# EAGLE design Shruthi-Analog-Polivoks-v01 (EAGLE 5.09)
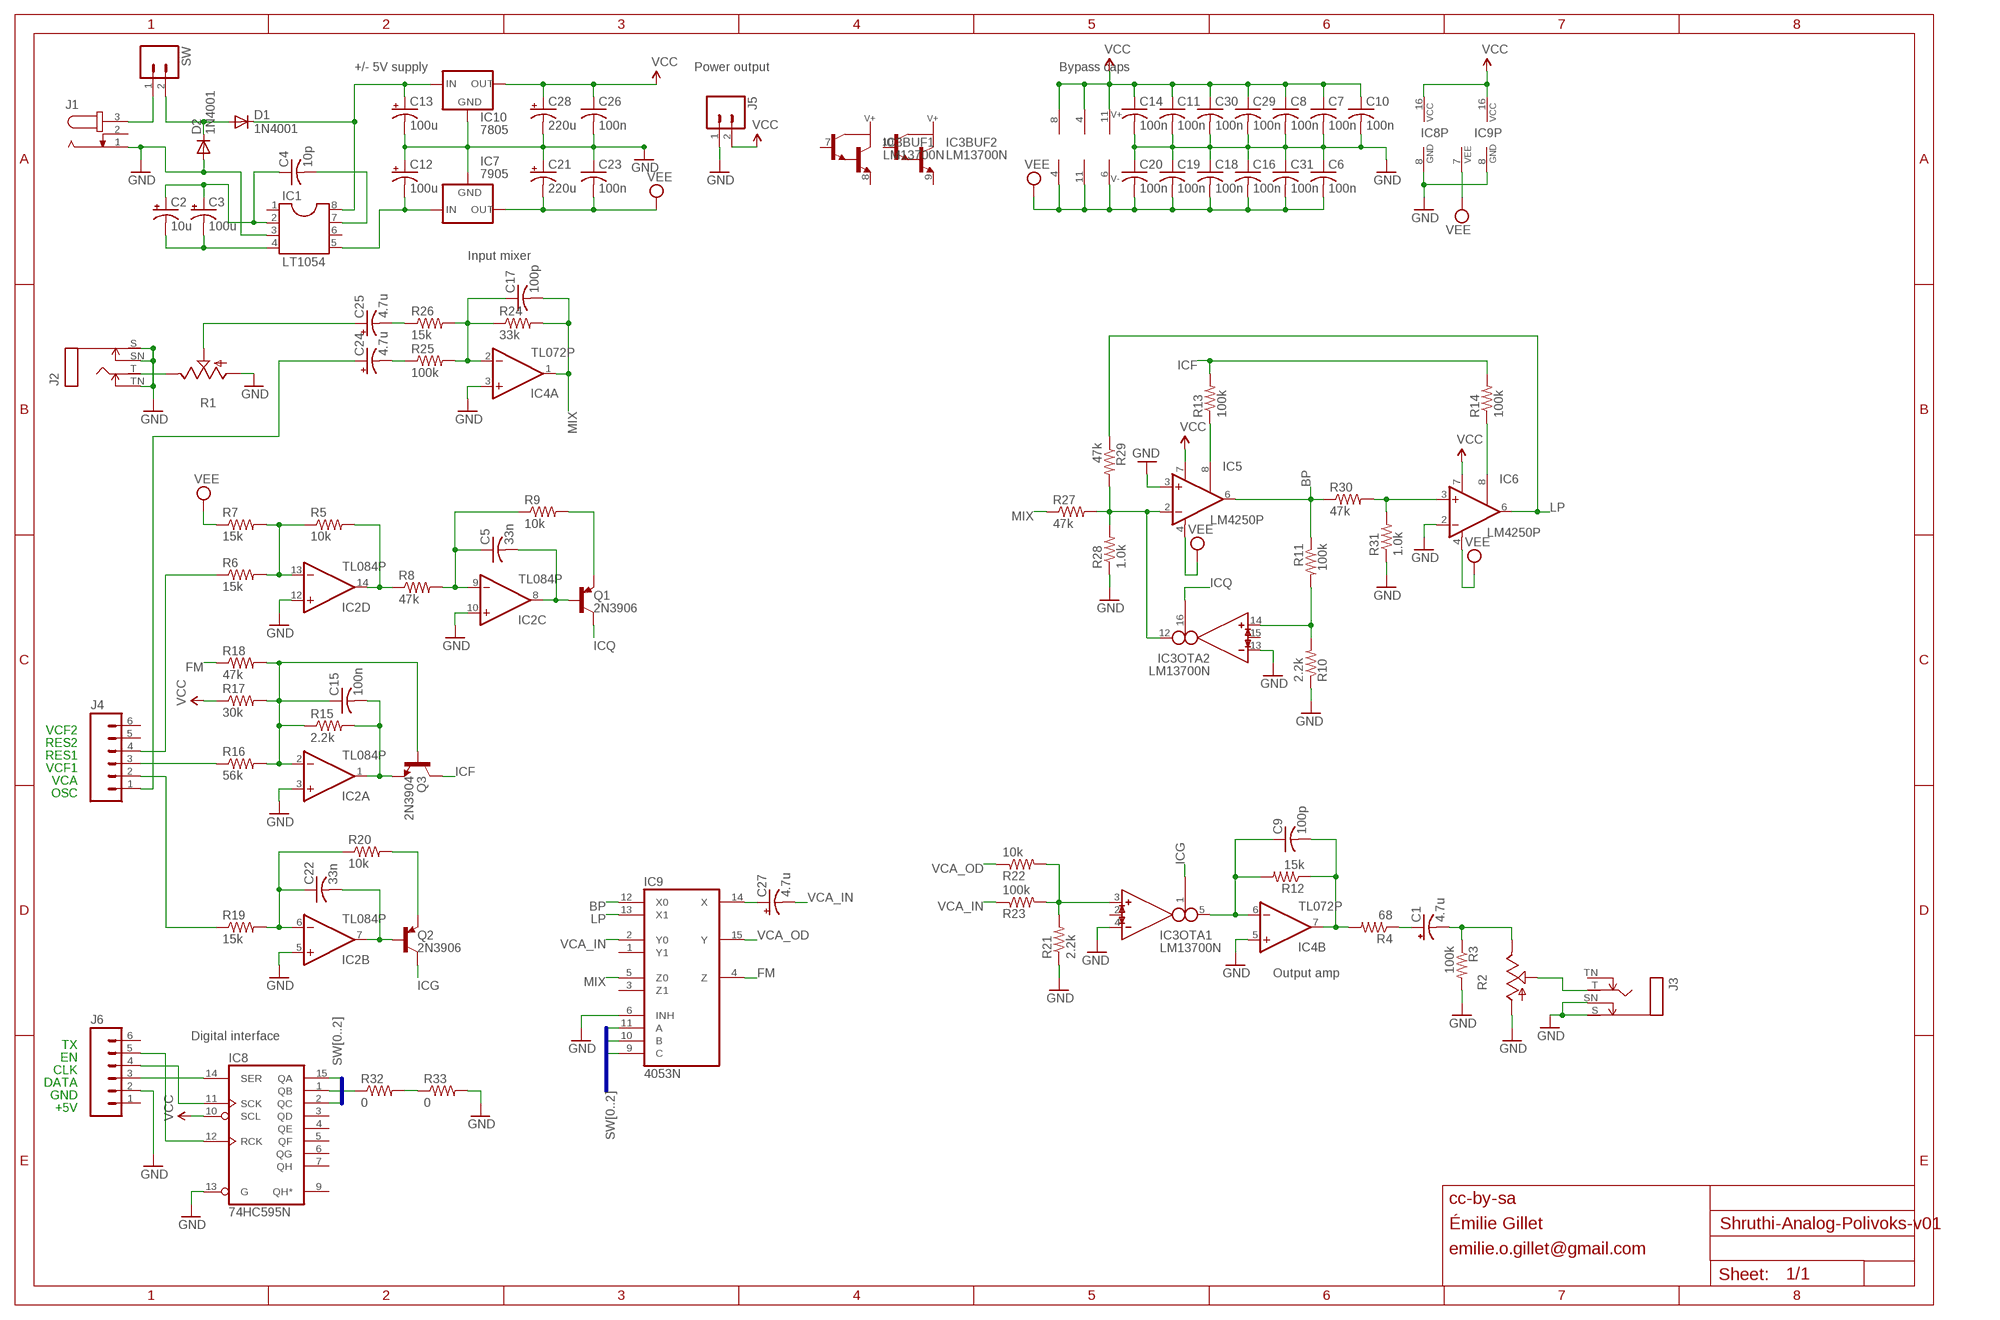
[diagram p0: schematic, sheet 1]

## Parts
C1  4.7u  CPOL-USE2.5-6  [E2,5-6]
C2  10u  CPOL-USE2.5-5  [E2,5-5]
C3  100u  CPOL-USE2.5-6  [E2,5-6]
C4  10p  C-US025-025X050  [C025-025X050]
C5  33n  C-US050-025X075  [C050-025X075]
C6  100n  C-US025-025X050  [C025-025X050]
C7  100n  C-US025-025X050  [C025-025X050]
C8  100n  C-US025-025X050  [C025-025X050]
C9  100p  C-US025-025X050  [C025-025X050]
C10  100n  C-US025-025X050  [C025-025X050]
C11  100n  C-US025-025X050  [C025-025X050]
C12  100u  CPOL-USE2.5-7  [E2,5-7]
C13  100u  CPOL-USE2.5-7  [E2,5-7]
C14  100n  C-US025-025X050  [C025-025X050]
C15  100n  C-US025-025X050  [C025-025X050]
C16  100n  C-US025-025X050  [C025-025X050]
C17  100p  C-US025-025X050  [C025-025X050]
C18  100n  C-US025-025X050  [C025-025X050]
C19  100n  C-US025-025X050  [C025-025X050]
C20  100n  C-US025-025X050  [C025-025X050]
C21  220u  CPOL-USE5-10.5  [E5-10,5]
C22  33n  C-US050-025X075  [C050-025X075]
C23  100n  C-US025-025X050  [C025-025X050]
C24  4.7u  CPOL-USE2.5-6  [E2,5-6]
C25  4.7u  CPOL-USE2.5-6  [E2,5-6]
C26  100n  C-US025-025X050  [C025-025X050]
C27  4.7u  CPOL-USE2.5-6  [E2,5-6]
C28  220u  CPOL-USE5-10.5  [E5-10,5]
C29  100n  C-US025-025X050  [C025-025X050]
C30  100n  C-US025-025X050  [C025-025X050]
C31  100n  C-US025-025X050  [C025-025X050]
D1  1N4001  1N4004  [DO41-10]
D2  1N4001  1N4004  [DO41-10]
IC1  LT1054  DIL8  [DIL08]
IC2  TL084P  [DIL14]
IC3  LM13700N  [DIL16]
IC4  TL072P  [DIL08]
IC5  LM4250P  [DIL08]
IC6  LM4250P  [DIL08]
IC7  7905  79XXS  [79XXS]
IC8  74HC595N  [DIL16]
IC9  4053N  [DIL16]
IC10  7805  78XXS  [78XXS]
J1  JACK-PLUG2  [SPC4078_BIG_HOLES]
J2  MONOSWS  [NMJ4HC-S]
J3  MONOSWS  [NMJ4HC-S]
J4  M06SIP  [1X06]
J5  M02PTH  [1X02]
J6  M06SIP  [1X06]
Q1  2N3906  2N3906-  [TO92-]
Q2  2N3906  2N3906-  [TO92-]
Q3  2N3904  [TO92-]
R1  POT_USCABLED  [CABLE_POT_6MM]
R2  POT_USCABLED  [CABLE_POT_6MM]
R3  100k  R-US_0204/7  [0204/7]
R4  68  R-US_0204/7  [0204/7]
R5  10k  R-US_0204/7  [0204/7]
R6  15k  R-US_0204/7  [0204/7]
R7  15k  R-US_0204/7  [0204/7]
R8  47k  R-US_0204/7  [0204/7]
R9  10k  R-US_0204/7  [0204/7]
R10  2.2k  R-US_0204/7  [0204/7]
R11  100k  R-US_0204/7  [0204/7]
R12  15k  R-US_0204/7  [0204/7]
R13  100k  R-US_0204/7  [0204/7]
R14  100k  R-US_0204/7  [0204/7]
R15  2.2k  R-US_0204/7  [0204/7]
R16  56k  R-US_0204/7  [0204/7]
R17  30k  R-US_0204/7  [0204/7]
R18  47k  R-US_0204/7  [0204/7]
R19  15k  R-US_0204/7  [0204/7]
R20  10k  R-US_0204/7  [0204/7]
R21  2.2k  R-US_0204/7  [0204/7]
R22  10k  R-US_0204/7  [0204/7]
R23  100k  R-US_0204/7  [0204/7]
R24  33k  R-US_0204/7  [0204/7]
R25  100k  R-US_0204/7  [0204/7]
R26  15k  R-US_0204/7  [0204/7]
R27  47k  R-US_0204/7  [0204/7]
R28  1.0k  R-US_0204/7  [0204/7]
R29  47k  R-US_0204/7  [0204/7]
R30  47k  R-US_0204/7  [0204/7]
R31  1.0k  R-US_0204/7  [0204/7]
R32  0  R-US_0204/2V  [0204V]
R33  0  R-US_0204/2V  [0204V]
SW  M02PTH  [1X02]

## Nets
BP: IC5.6(OUT) IC9.12(X0) R11.1 R30.1
FM: IC9.4(Z) R18.1
FREQ1: C15.2 IC2.1(A:OUT) Q3.3(E) R15.2
FREQ2: C5.2 IC2.8(C:OUT) Q1.2(B)
GND: C6.1 C7.2 C8.2 C10.2 C11.2 C12.+ C13.- C14.2 C16.1 C18.1 C19.1 C20.1 C21.+ C23.1 C26.2 C28.- C29.2 C30.2 C31.1 D2.A IC1.3 IC2.3(A:+IN) IC2.5(B:+IN) IC2.10(C:+IN) IC2.12(D:+IN) IC3.4(OTA1:IN_N) IC3.13(OTA2:IN_N) IC4.3(A:+IN) IC4.5(B:+IN) IC5.3(+IN) IC6.2(-IN) IC7.GND IC8.8(GND) IC8.13(G) IC9.6(INH) IC9.8(GND) IC10.GND J1.1 J2.S J2.SN J2.TN J3.S J3.SN J5.1 J6.2 R1.A R2.A R3.2 R10.1 R21.1 R28.1 R31.1 R33.2
ICF: Q3.1(C) R13.2 R14.2
ICG: IC3.1(OTA1:I_BIAS) Q2.1(C)
ICQ: IC3.16(OTA2:I_BIAS) Q1.1(C)
LP: IC6.6(OUT) IC9.13(X1) R29.1
MIX: C17.2 IC4.1(A:OUT) IC9.5(Z0) R24.2 R27.1
N$1: C2.+ C3.+ C4.1 IC1.2
N$2: J4.4 R6.1
N$3: J1.3 SW.1
N$4: C13.+ D1.C IC1.8 IC10.IN
N$5: C2.- C3.- IC1.4
N$6: C17.1 IC4.2(A:-IN) R24.1 R25.2 R26.2
N$7: C22.1 IC2.6(B:-IN) R19.2 R20.1
N$9: C5.1 IC2.9(C:-IN) R8.2 R9.1
N$10: Q2.3(E) R20.2
N$11: Q1.3(E) R9.2
N$12: IC3.12(OTA2:OUT) IC5.2(-IN) R27.2 R28.2 R29.2
N$13: IC8.12(RCK) J6.5
N$14: IC8.14(SER) J6.3
N$16: IC8.11(SCK) J6.4
N$17: C27.+ IC9.14(X)
N$18: IC3.3(OTA1:IN_P) R21.2 R22.2 R23.2
N$19: IC3.14(OTA2:IN_P) R10.2 R11.2
N$20: IC6.3(+IN) R30.2 R31.2
N$21: J4.2 R19.1
N$22: IC2.13(D:-IN) R5.1 R6.2 R7.2
N$23: IC5.8(ISET) R13.1
N$24: IC6.8(ISET) R14.1
N$25: C1.+ R4.1
N$26: R32.2 R33.1
N$27: IC2.14(D:OUT) R5.2 R8.1
N$32: C1.- R2.E R3.1
N$35: C24.+ J4.1
N$36: C4.2 IC1.7
N$38: J2.T R1.E
N$39: C24.- R25.1
N$40: C15.1 IC2.2(A:-IN) Q3.2(B) R15.1 R16.2 R17.2 R18.2
N$42: J4.3 R16.1
N$47: J3.T R2.S
N$58: C12.- IC1.5 IC7.IN
N$59: D1.A D2.C SW.2
N$63: C9.2 IC4.7(B:OUT) R4.2 R12.1
N$66: C25.+ R1.S
N$70: C9.1 IC3.5(OTA1:OUT) IC4.6(B:-IN) R12.2
N$72: C25.- R26.1
SW0: IC8.15(QA) IC9.9(C)
SW1: IC8.1(QB) IC9.10(B) R32.1
SW2: IC8.2(QC) IC9.11(A)
VCA_IN: C27.- IC9.2(Y0) R23.1
VCA_OD: IC9.15(Y) R22.1
VCC: C7.1 C8.1 C10.1 C11.1 C14.1 C26.1 C28.+ C29.1 C30.1 IC2.4(P:V+) IC3.11(SUPPLY:V+) IC4.8(P:V+) IC5.7(V+) IC6.7(V+) IC8.10(SCL) IC8.16(VCC) IC9.16(VCC) IC10.OUT J5.2 R17.1
VEE: C6.2 C16.2 C18.2 C19.2 C20.2 C21.- C23.2 C31.2 IC2.11(P:V-) IC3.6(SUPPLY:V-) IC4.4(P:V-) IC5.4(V-) IC6.4(V-) IC7.OUT IC9.7(VEE) R7.1
X: C22.2 IC2.7(B:OUT) Q2.2(B)
Unconnected: IC1.1 IC1.6 IC3.2(OTA1:I_DIODE) IC3.7(BUF1:B) IC3.8(BUF1:E) IC3.9(BUF2:E) IC3.10(BUF2:B) IC3.15(OTA2:I_DIODE) IC8.3(QD) IC8.4(QE) IC8.5(QF) IC8.6(QG) IC8.7(QH) IC8.9(QH*) IC9.1(Y1) IC9.3(Z1) J1.2 J3.TN J4.5 J4.6 J6.1 J6.6

## Buses
SW[0..2]

## Notes on the sheet
- +/- 5V supply | Power output | Bypass caps
- Input mixer
- VCF2
- RES2
- RES1
- VCF1
- VCA
- OSC
- Output amp
- TX | Digital interface
- EN
- CLK
- DATA
- GND
- +5V
- cc-by-sa
- Émilie Gillet
- emilie.o.gillet@gmail.com

## Library data of the parts
C1-C3 C12 C13 C21 C24 C25 C27 C28 = rcl:CPOL-US: POLARIZED CAPACITOR, American symbol
C4-C11 C14-C20 C22 C23 C26 C29-C31 = rcl:C-US: CAPACITOR, American symbol
D1 D2 = diode:1N4004: DIODE general purpose rectifier, 1 A
IC1 = ic-package:DIL8: Dual In Line / Socket
IC2 = linear:TL084: OP AMP
IC3 = ota:LM13700: Dual OTA with buffers
IC4 = gm-ics:TL072: OP AMP
IC5 IC6 = og-ics:LM4250: OP AMP
IC7 = v-reg:79XXS: VOLTAGE REGULATOR
IC8 = 74xx-eu:74*595: 8-bit SHIFT REGISTER, output latch
IC9 = 40xx:4053: Triple 2-channel ANALOG MULTIPLEXER
IC10 = v-reg:78XXS: VOLTAGE REGULATOR
J1 = con-jack2:JACK-PLUG: DC POWER JACK Power Jack, DC, Right Angle, Through Hole, Rated 5A at 16VDC, PC Terminals Distributor: Farnell (www.Farnell.de) Drawing: 84N1161.pdf / 84N1162.pdf Manufacturer: SPC Technology (www.spctechnology.com) Type: SPC4077 / SPC 4078
J2 J3 = gm-jacks:MONOSW
J4 J6 = SparkFun:M06: Header 6 Standard 6-pin 0.1" header. Use with straight break away headers (SKU : PRT-00116), right angle break away headers (PRT-00553), swiss pins (PRT-00743), machine pins (PRT-00117), and female headers (PRT-00115). Molex polarized connector foot print use with SKU : PRT-08094 with associated crimp pins and housings. NOTES ON THE VARIANTS LOCK and LOCK_LONGPADS... This footprint was designed to help hold the alignment of a through-hole component (i.e. 6-pin header) while soldering it into place. You may notice that each hole has been shifted either up or down by 0.005 of an inch from it's more standard position (which is a perfectly straight line). This slight alteration caused the pins (the squares in the middle) to touch the edges of the holes. Because they are alternating, it causes a "brace" to hold the component in place. 0.005 has proven to be the perfect amount of "off-center" position when using our standard breakaway headers. Although looks a little odd when you look at the bare footprint, once you have a header in there, the alteration is very hard to notice. Also, if you push a header all the way into place, it is covered up entirely on the bottom side. This idea of altering the position of holes to aid alignment will be further integrated into the Sparkfun Library for other footprints. It can help hold any component with 3 or more connection pins.
J5 SW = SparkFun:M02: Header 2 Standard 2-pin 0.1" header. Use with straight break away headers (SKU : PRT-00116), right angle break away headers (PRT-00553), swiss pins (PRT-00743), machine pins (PRT-00117), and female headers (PRT-00115). Molex polarized connector foot print use with SKU : PRT-08233 with associated crimp pins and housings.
Q1 Q2 = gm-trans:2N3906: PNP Transistor
Q3 = gm-trans:2N3904: NPN Transistor
R1 R2 = pot-alps:POT_US
R3-R33 = rcl:R-US_: RESISTOR, American symbol

## Board
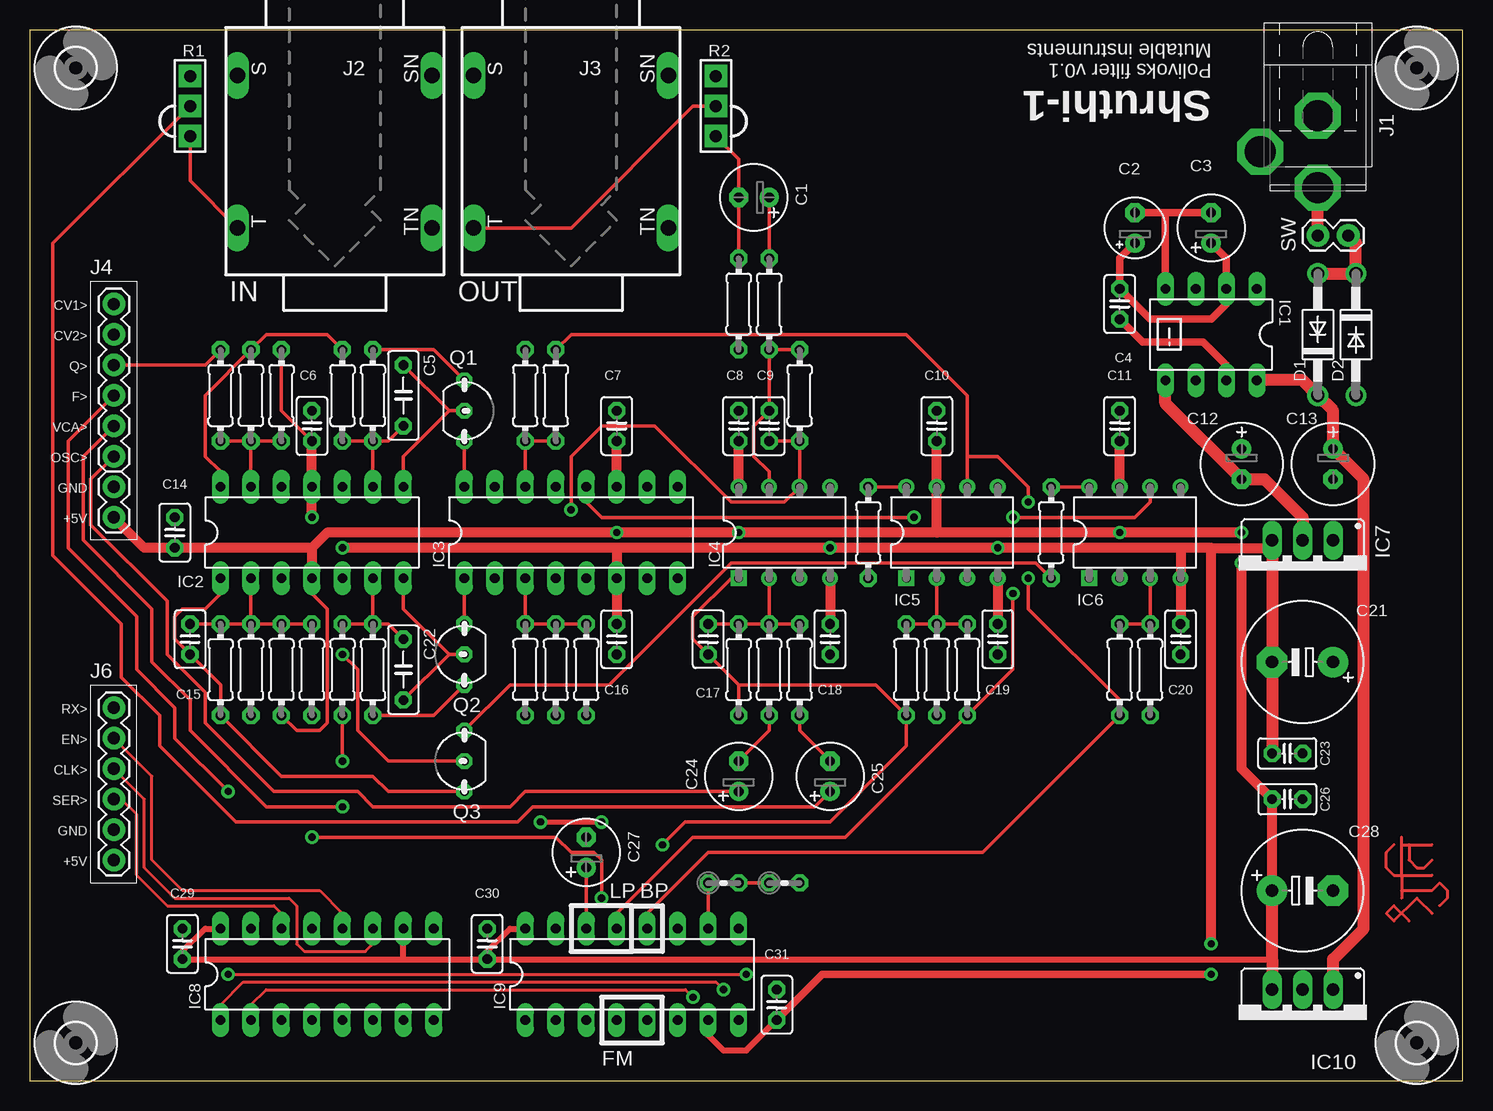
[diagram p1: board, top side]
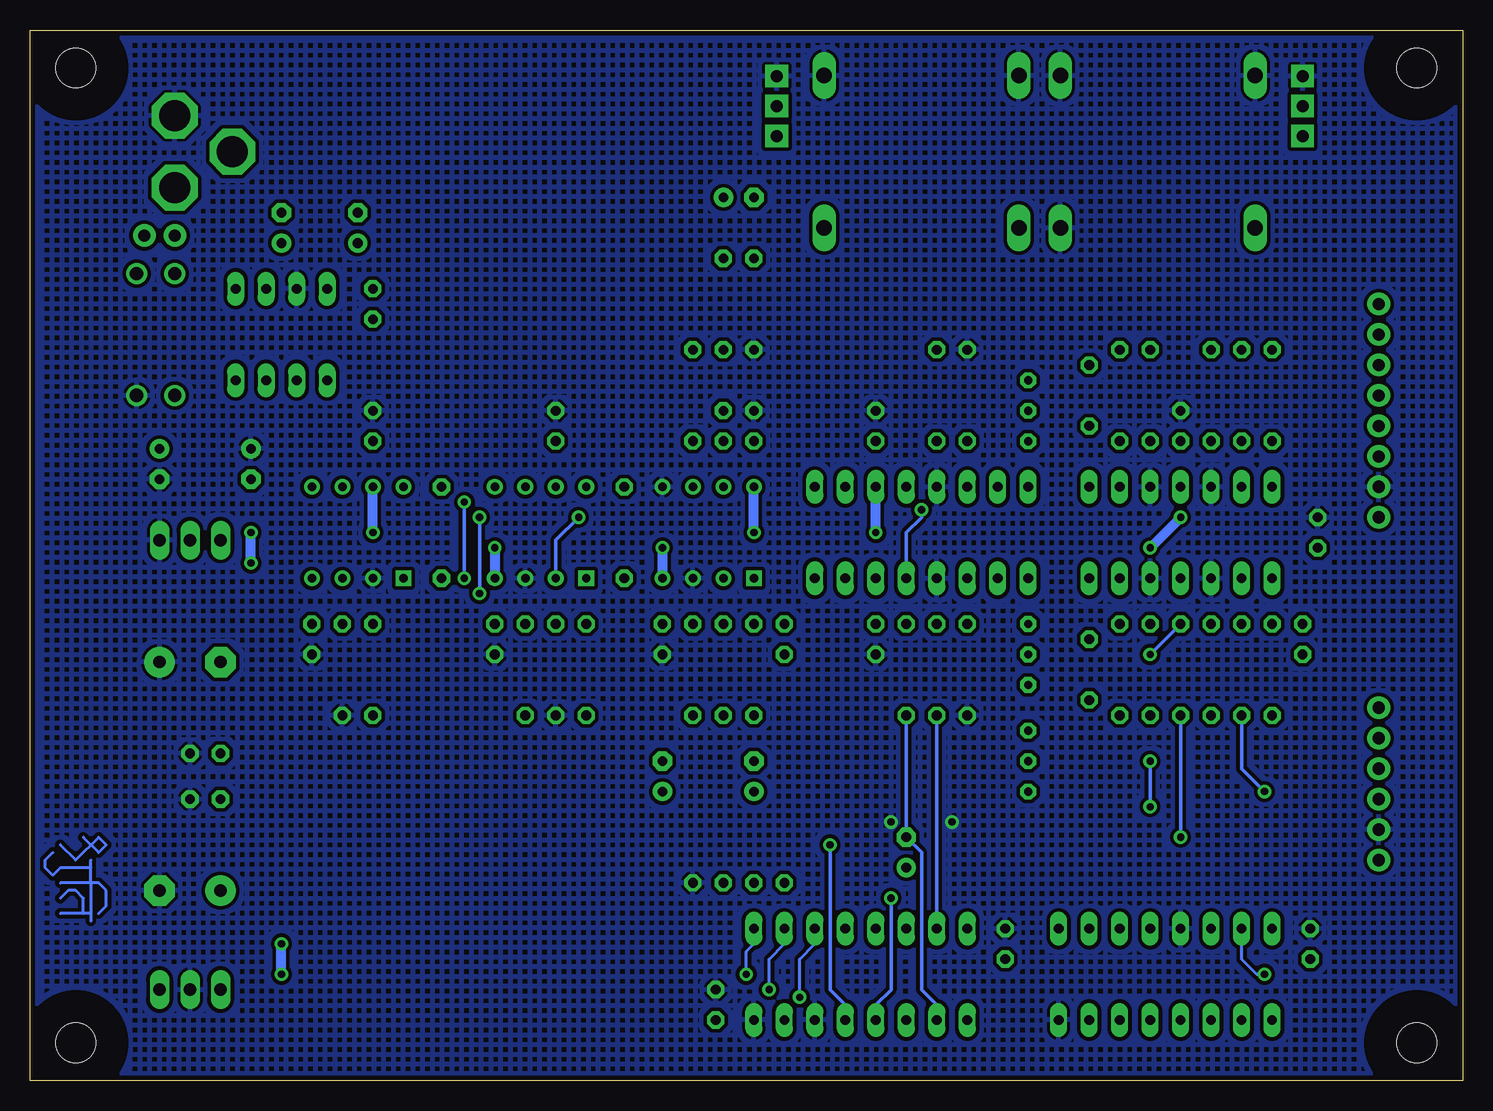
[diagram p2: board, bottom side, seen from below]

Size 119.38 x 87.62 mm. Coordinates in mm from the lower left corner, seen from the top.
Outline: 0,0 119.38,0 119.38,87.62 0,87.62 0,0
Copper layers (1*16): Top 0.035mm / dielectric 1.5mm / Bottom 0.035mm
Design rules "SparkFun_10mil *": minimum track width 10mil, minimum drill 20mil, track to track 10mil, track to pad 10mil, pad to pad 10mil, via to via 10mil, smd to smd 10mil, copper to edge 10mil, drill to drill 10mil, minimum pad ring 12mil, minimum via ring 10mil, stop-mask expansion 4mil, vias tented up to drill 25mil, thermal gap 10mil

### Footprints (pad centres in the part's own frame; a part is rotated, then mirrored left to right if it is on the bottom)
3,3 = hole 3.3: 0,0
E2,5-6 = drill 0.813 pad 1.6 round: + -1.27,0 | drill 0.813 pad 1.6 octagon: - 1.27,0
E2,5-5 = drill 0.813 pad 1.6 round: + -1.27,0 | drill 0.813 pad 1.6 octagon: - 1.27,0
C025-025X050 = drill 0.813 octagon: 1 -1.27,0; 2 1.27,0
C050-025X075 = drill 0.813 octagon: 1 -2.54,0; 2 2.54,0
E2,5-7 = drill 0.813 pad 1.6 round: + -1.27,0 | drill 0.813 pad 1.6 octagon: - 1.27,0
E5-10,5 = drill 1.016 pad 2.54 round: + -2.54,0 | drill 1.016 pad 2.54 octagon: - 2.54,0
DO41-10 = drill 1.118 round: A 5.08,0; C -5.08,0
DIL08 = drill 0.813 long: 1 -3.81,-3.81; 2 -1.27,-3.81; 3 1.27,-3.81; 4 3.81,-3.81; 5 3.81,3.81; 6 1.27,3.81; 7 -1.27,3.81; 8 -3.81,3.81
DIL14 = drill 0.813 long: 1 -7.62,-3.81; 2 -5.08,-3.81; 3 -2.54,-3.81; 4 0,-3.81; 5 2.54,-3.81; 6 5.08,-3.81; 7 7.62,-3.81; 8 7.62,3.81; 9 5.08,3.81; 10 2.54,3.81; 11 0,3.81; 12 -2.54,3.81; 13 -5.08,3.81; 14 -7.62,3.81
DIL16 = drill 0.813 long: 1 -8.89,-3.81; 2 -6.35,-3.81; 3 -3.81,-3.81; 4 -1.27,-3.81; 5 1.27,-3.81; 6 3.81,-3.81; 7 6.35,-3.81; 8 8.89,-3.81; 9 8.89,3.81; 10 6.35,3.81; 11 3.81,3.81; 12 1.27,3.81; 13 -1.27,3.81; 14 -3.81,3.81; 15 -6.35,3.81; 16 -8.89,3.81
DIL08' = drill 0.7 square: 1 -3.81,-3.81 | drill 0.7 round: 2 -1.27,-3.81; 3 1.27,-3.81; 4 3.81,-3.81; 5 3.81,3.81; 6 1.27,3.81; 7 -1.27,3.81; 8 -3.81,3.81
79XXS = drill 1.016 long: GND -2.54,-2.54; IN 0,-2.54; OUT 2.54,-2.54
78XXS = drill 1.016 long: GND 0,-2.54; IN -2.54,-2.54; OUT 2.54,-2.54
SPC4078_BIG_HOLES = drill 2.6 pad 3.81 octagon: 1 -0.46,0; 2 2.54,-4.8; 3 5.54,0
NMJ4HC-S = drill 1.3 long: S 5.08,8.115; SN 5.08,-8.115; T -7.62,8.115; TN -7.62,-8.115
1X06 = drill 1.016 pad 1.88 round: 1 0,0; 2 2.54,0; 3 5.08,0; 4 7.62,0; 5 10.16,0; 6 12.7,0
1X02 = drill 1.016 pad 1.88 round: 1 0,0; 2 2.54,0
TO92- = drill 0.7 octagon: 1 2.54,0; 2 0,0; 3 -2.54,0
CABLE_POT_6MM = drill 1 pad 1.88 square: A -2.5,0; E 2.5,0; S 0,0
0204/7 = drill 0.813 octagon: 1 -3.81,0; 2 3.81,0
0204V = drill 0.813 octagon: 1 -1.27,0; 2 1.27,0

### Placement (x,y rotation side)
$$U$4  [3,3]  115.57,3.17 0 top
C1  60.33,73.66 180 top
C2  92.08,71.12 90 top
C3  98.42,71.12 90 top
C4  90.8,64.77 270 top
C5  31.11,57.15 90 top
C6  23.5,54.61 270 top
C7  48.89,54.61 90 top
C8  59.05,54.61 90 top
C9  61.59,54.61 90 top
C10  75.56,54.61 90 top
C11  90.8,54.61 90 top
C12  100.97,51.44 270 top
C13  108.58,51.44 270 top
C14  12.07,45.72 90 top
C15  13.34,36.83 270 top
C16  48.89,36.83 90 top
C17  56.52,36.83 270 top
C18  66.67,36.83 90 top
C19  80.64,36.83 90 top
C20  95.89,36.83 90 top
C21  106.05,34.92 180 top
C22  31.11,34.29 270 top
C23  104.78,27.3 180 top
C24  59.05,25.4 90 top
C25  66.67,25.4 90 top
C26  104.78,23.49 0 top
C27  46.35,19.05 90 top
C28  106.05,15.88 0 top
C29  12.7,11.43 90 top
C30  38.1,11.43 90 top
C31  62.23,6.35 270 top
D1  107.31,62.23 90 top
D2  110.49,62.23 270 top
IC1  98.42,62.23 180 top
IC2  23.5,45.72 0 top
IC3  45.09,45.72 0 top
IC4  TL072P  [DIL08']  62.87,45.72 0 top
IC5  LM4250P  [DIL08']  76.83,45.72 0 top
IC6  LM4250P  [DIL08']  92.08,45.72 0 top
IC7  106.05,42.55 180 top
IC8  24.77,8.89 0 top
IC9  50.16,8.89 0 top
IC10  106.05,5.08 180 top
J1  107.31,80.01 270 top
J2  25.4,78.74 90 top
J3  45.09,78.74 90 top
J4  6.99,52.07 90 top
J5  6.99,49.53 270 top
J6  6.99,18.41 90 top
Q1  36.2,55.88 270 top
Q2  36.2,35.56 90 top
Q3  36.2,26.67 90 top
R1  13.34,81.28 270 top
R2  57.15,81.28 270 top
R3  59.05,64.77 270 top
R4  61.59,64.77 270 top
R5  18.41,57.15 90 top
R6  15.88,57.15 270 top
R7  20.96,57.15 270 top
R8  26.04,57.15 270 top
R9  28.57,57.15 90 top
R10  41.27,57.15 270 top
R11  43.81,57.15 270 top
R12  64.14,57.15 270 top
R13  69.85,45.72 270 top
R14  85.09,45.72 270 top
R15  15.88,34.29 270 top
R16  18.41,34.29 90 top
R17  20.96,34.29 90 top
R18  23.5,34.29 90 top
R19  26.04,34.29 90 top
R20  28.57,34.29 270 top
R21  41.27,34.29 90 top
R22  43.81,34.29 90 top
R23  46.35,34.29 90 top
R24  59.05,34.29 270 top
R25  61.59,34.29 90 top
R26  64.14,34.29 90 top
R27  73.03,34.29 90 top
R28  75.56,34.29 90 top
R29  78.11,34.29 90 top
R30  90.8,34.29 90 top
R31  93.34,34.29 90 top
R32  57.78,16.51 0 top
R33  62.87,16.51 0 top
SW  107.31,70.48 0 top
U$1  [3,3]  3.81,84.45 0 top
U$2  [3,3]  115.57,84.45 0 top
U$3  [3,3]  3.81,3.17 0 top
U$4  [ANUSHKA]  72.39,0.64 0 top
U$5  [SHRUTHI_LOGO_RUSSIAN]  72.39,22.22 0 top

### Tracks (layer width: path | path; a pad name or v marks a point on that pad's centre or on a via)
BP  (via drill 0.6)
  Top 0.305: IC9.12 51.44,13.97 56.52,19.05 79.38,19.05 R30.1 90.8,31.75 83.19,39.37 v83.19,41.91 | R11.1 45.09,62.23 73.03,62.23 78.11,57.15 78.11,52.07 | 78.11,52.07 IC5.6 | v83.19,48.26 83.19,49.53 80.64,52.07 78.11,52.07
  Bottom 0.305: v83.19,41.91 v83.19,48.26
FM  (via drill 0.6)
  Top 0.305: v23.5,20.32 43.81,20.32 45.09,19.05 46.99,19.05 47.62,18.41 v47.62,15.24
  Bottom 0.305: IC9.4 48.89,6.35 47.62,7.62 v47.62,15.24 | v23.5,20.32 R18.1
FREQ1
  Top 0.305: IC2.1 15.88,40.64 14.61,39.37 12.7,39.37 12.07,38.73 12.07,36.83 C15.2 15.88,33.02 R15.2 20.96,25.4 28.57,25.4 29.84,24.13 Q3.3
FREQ2
  Top 0.305: IC2.8 31.11,52.07 34.93,55.88 | 34.93,55.88 Q1.2 | 34.93,55.88 C5.2
GND  (via drill 0.6)
  Top 0.406: v42.55,21.59 v47.62,21.59
  pour Bottom (isolate 0.305, hatched): 0.64,87 0.64,0.64 118.75,0.64 118.75,87
ICF
  Top 0.305: R14.2 83.82,43.18 69.85,43.18 | 69.85,43.18 58.42,43.18 48.26,33.02 40.01,33.02 Q3.1 | 69.85,43.18 R13.2
ICG
  Top 0.305: Q2.1 IC3.1
ICQ
  Top 0.305: IC3.16 Q1.1
LP  (via drill 0.6)
  Top 0.305: IC9.13 48.89,13.97 55.24,20.32 67.95,20.32 R29.1 81.92,34.29 v81.92,40.64 | v81.92,46.99 92.08,46.99 93.34,48.26 IC6.6
  Bottom 0.305: v81.92,40.64 v81.92,46.99
MIX  (via drill 0.6)
  Top 0.305: IC4.1 58.42,41.91 55.24,38.73 55.24,36.83 C17.2 59.05,33.02 | 59.05,33.02 70.48,33.02 R27.1 73.03,27.94 66.67,21.59 54.61,21.59 v52.7,19.68 | 59.05,33.02 R24.2
  Bottom 0.305: IC9.5 51.44,6.35 52.7,7.62 v52.7,19.68
N$1
  Top 0.61: C3.+ 99.69,68.58 IC1.2 99.69,64.77 98.42,63.5 93.34,63.5 C4.1 90.8,68.58 C2.+
N$2
  Top 0.305: J4.4 14.61,59.69 R6.1
N$3
  Top 1.016: SW.1 J1.3
N$4
  Top 1.016: IC1.8 106.05,58.42 D1.C 108.58,55.88 C13.+ 111.12,50.16 111.12,12.7 108.58,10.16 IC10.IN
N$5
  Top 0.61: 94.61,72.39 C2.- | 94.61,72.39 C3.- | IC1.4 94.61,72.39
N$6
  Top 0.305: R25.2 IC4.2 | R25.2 R26.2 | R25.2 R24.1 C17.1
N$7
  Top 0.305: R19.2 R20.1 | R20.1 IC2.6 | R20.1 29.84,38.1 C22.1
N$9
  Top 0.305: R9.1 IC2.9 | R8.2 R9.1 | R9.1 29.84,53.34 C5.1
N$10
  Top 0.305: Q2.3 33.66,30.48 R20.2
N$11
  Top 0.305: R9.2 33.66,60.96 Q1.3
N$12  (via drill 0.6)
  Top 0.305: IC5.2 R28.2 | R28.2 R29.2 | R28.2 R27.2 | IC3.12 46.35,48.26 47.62,46.99 v73.66,46.99
  Bottom 0.305: v73.66,46.99 75.56,45.09 IC5.2
N$13
  Top 0.254: IC8.12 26.04,13.97 24.13,15.88 12.7,15.88 10.16,18.41 10.16,25.4 J6.5
N$14
  Top 0.254: IC8.14 20.96,13.97 20.32,14.61 11.43,14.61 8.89,17.14 8.89,22.22 7.62,23.49 J6.3
N$15
  Bottom 0.254: 116.84,19.68 115.57,18.41 113.67,20.32 113.03,19.68 113.67,19.05 114.94,20.32
N$16
  Top 0.254: IC8.11 28.57,11.43 27.94,10.79 22.86,10.79 22.23,11.43 22.23,14.61 21.59,15.24 12.07,15.24 9.53,17.78 9.53,23.49 J6.4
N$17
  Top 0.305: IC9.14 C27.+
N$18
  Top 0.305: IC3.3 R21.2 R22.2 R23.2
N$19
  Top 0.305: IC3.14 R10.2 R11.2
N$20
  Top 0.305: IC6.3 R31.2 R30.2
N$21  (via drill 0.6)
  Top 0.305: J4.2 4.45,52.07 4.45,45.09 10.16,39.37 10.16,34.92 13.34,31.75 13.34,29.21 19.68,22.86 v26.04,22.86 | v26.04,26.67 R19.1
  Bottom 0.305: v26.04,22.86 v26.04,26.67
N$22
  Top 0.305: R5.1 R7.2 | R5.1 R6.2 | IC2.13 R5.1
N$23
  Top 0.305: R13.1 IC5.8
N$24
  Top 0.305: R14.1 IC6.8
N$25
  Top 0.305: R4.1 C1.+
N$26
  Top 0.305: R32.2 R33.1
N$27
  Top 0.305: IC2.14 15.88,50.8 14.61,52.07 14.61,57.15 R5.2 19.68,62.23 24.77,62.23 R8.1
N$32
  Top 0.305: R3.1 C1.- 59.05,76.84 57.15,78.74 R2.E
N$35
  Top 0.305: J4.1 5.08,50.16 5.08,46.36 11.43,40.01 11.43,35.56 14.61,32.38 14.61,29.84 20.32,24.13 27.3,24.13 28.57,22.86 40.01,22.86 41.27,24.13 C24.+
N$36
  Top 0.61: IC1.7 99.69,59.69 97.79,61.59 92.71,61.59 C4.2
N$38
  Top 0.305: J2.T 13.34,75.07 R1.E
N$39
  Top 0.305: C24.- 61.59,29.21 R25.1
N$40  (via drill 0.6)
  Top 0.305: R16.2 IC2.2 | R16.2 R15.1 C15.1 | R16.2 R17.2 R18.2 | Q3.2 29.84,26.67 27.3,29.21 27.3,34.29 v26.04,35.56
  Bottom 0.305: R18.2 v26.04,35.56
N$42  (via drill 0.6)
  Top 0.305: J4.3 3.18,53.34 3.18,44.45 8.89,38.73 8.89,34.29 12.07,31.11 12.07,28.57 v16.51,24.13
  Bottom 0.305: R16.1 18.41,26.04 v16.51,24.13
N$47
  Top 0.305: R2.S 55.24,81.28 45.09,71.12 J3.T
N$52
  Bottom 0.254: 114.3,17.78 114.3,18.41 | 114.3,16.51 114.3,17.78 | 114.3,16.51 114.3,13.97 | 114.3,13.97 114.3,13.34 | 114.94,13.97 116.84,13.97 | 114.3,13.97 114.94,13.97 | 114.94,13.97 114.94,15.24 115.57,15.88 116.2,15.88 116.84,15.24 | 114.3,17.78 116.84,17.78 117.47,17.14 118.11,17.78 118.11,18.41 117.47,19.05 | 114.3,16.51 116.84,16.51 | 114.3,16.51 113.67,16.51 113.03,15.88 113.03,14.61 113.67,13.97
N$53
  Top 0.254: 116.84,13.97 115.57,15.24 113.67,13.34 113.03,13.97 113.67,14.61 114.94,13.34
N$54
  Top 0.254: 114.3,15.88 114.3,15.24 | 114.3,17.14 114.3,15.88 | 114.3,17.14 114.3,19.68 | 114.3,19.68 114.3,20.32 | 114.94,19.68 116.84,19.68 | 114.3,19.68 114.94,19.68 | 114.94,19.68 114.94,18.41 115.57,17.78 116.2,17.78 116.84,18.41 | 114.3,15.88 116.84,15.88 117.47,16.51 118.11,15.88 118.11,15.24 117.47,14.61 | 114.3,17.14 116.84,17.14 | 114.3,17.14 113.67,17.14 113.03,17.78 113.03,19.05 113.67,19.68
N$58
  Top 1.016: IC1.5 94.61,56.52 C12.- 102.87,50.16 106.05,46.99 IC7.IN
N$59
  Top 1.016: D1.A D2.C 110.49,69.85 SW.2
N$63
  Top 0.305: IC4.7 61.59,50.8 60.33,52.07 60.33,54.61 C9.2 R4.2 R12.1
N$66
  Top 0.305: R1.S 1.91,69.85 1.91,43.82 7.62,38.1 7.62,33.66 10.79,30.48 10.79,27.94 17.14,21.59 40.64,21.59 41.91,22.86 65.41,22.86 C25.+
N$70  (via drill 0.6)
  Top 0.305: C9.1 R12.2 IC4.6 62.87,48.26 58.42,48.26 52.07,54.61 47.62,54.61 45.09,52.07 v45.09,47.62
  Bottom 0.305: IC3.5 46.35,45.72 45.09,46.99 v45.09,47.62
N$72
  Top 0.305: C25.- 64.14,29.21 R26.1
SW0  (via drill 0.6)
  Top 0.254: v16.51,8.89 v59.69,8.89
  Bottom 0.254: IC8.15 18.41,10.16 17.14,8.89 v16.51,8.89 | v59.69,8.89 59.69,10.79 59.05,11.43 IC9.9
SW1  (via drill 0.6)
  Top 0.254: v57.78,7.62 57.15,8.26 17.78,8.26 15.88,6.35 IC8.1
  Top 0.305: IC9.10 R32.1
  Bottom 0.254: IC9.10 56.52,11.43 57.78,10.16 v57.78,7.62
SW2  (via drill 0.6)
  Top 0.254: IC8.2 18.41,6.35 19.68,7.62 54.61,7.62 v55.24,6.98
  Bottom 0.254: v55.24,6.98 55.24,10.16 53.98,11.43 IC9.11
VCA_IN
  Bottom 0.305: IC9.2 43.81,6.35 45.09,7.62 45.09,19.05 C27.- R23.1
VCA_OD
  Bottom 0.305: IC9.15 R22.1
VCC  (via drill 0.6)
  Top 0.305: IC2.4 23.5,40.64 24.77,39.37 24.77,29.84 24.13,29.21 22.23,29.21 R17.1
  Top 0.508: 31.11,10.16 IC8.10 | C30.1 103.5,10.16 | 31.11,10.16 C30.1 | 31.11,10.16 C29.1 12.7,10.79 14.61,12.7 IC8.16 | IC9.16 40.01,12.7 38.1,10.79 C30.1
  Top 0.813: v100.97,43.18 100.97,26.04 C26.1 C28.+ | 75.56,45.72 v59.05,45.72 v48.89,45.72 24.77,45.72 23.5,44.45 | 75.56,45.72 v90.8,45.72 v100.97,45.72 | IC6.7 C11.1 | 75.56,45.72 IC5.7 C10.1 | IC4.8 C8.1 | IC3.11 C7.1 | 23.5,44.45 C14.1 9.53,44.45 J5.2 | 23.5,44.45 IC2.4
  Top 1.016: IC10.OUT 103.5,10.16 C28.+
  Bottom 0.813: v100.97,43.18 v100.97,45.72 | v48.89,45.72 IC3.11 | v59.05,45.72 IC4.8 | v90.8,45.72 IC6.7
VEE  (via drill 0.6)
  Top 0.305: R7.1 20.96,55.88 C6.2
  Top 0.508: IC9.7 56.52,3.81 57.78,2.54 59.69,2.54 C31.2
  Top 0.61: C31.2 66.04,8.89 v98.42,8.89
  Top 0.813: IC7.OUT 102.87,44.45 98.42,44.45 | 48.89,44.45 v26.04,44.45 | 48.89,44.45 v66.67,44.45 v80.64,44.45 95.89,44.45 | 98.42,44.45 95.89,44.45 | 95.89,44.45 IC6.4 C20.2 | 48.89,44.45 IC3.6 C16.2 | IC4.4 C18.2 | IC5.4 C19.2 | v23.5,46.99 IC2.11 C6.2 | v98.42,11.43 98.42,44.45
  Top 1.016: IC7.OUT C21.- C23.2
  Bottom 0.813: v80.64,44.45 IC5.4 | v66.67,44.45 IC4.4 | v26.04,44.45 v23.5,46.99 | v98.42,8.89 v98.42,11.43
X
  Top 0.305: IC2.7 31.11,39.37 34.93,35.56 | C22.2 34.93,35.56 | 34.93,35.56 Q2.2

### Text on the board
tPlace: Mutable instruments | CV1> | CV2> | Q> | F> | VCA> | OSC> | GND | +5V | RX> | EN> | CLK> | SER> | GND | +5V
tNames: Polivoks filter v0.1 | Shruthi-1 | IN | OUT | LP | BP | FM